# EAGLE design SCANOPCB V2 (EAGLE 7.7.0)
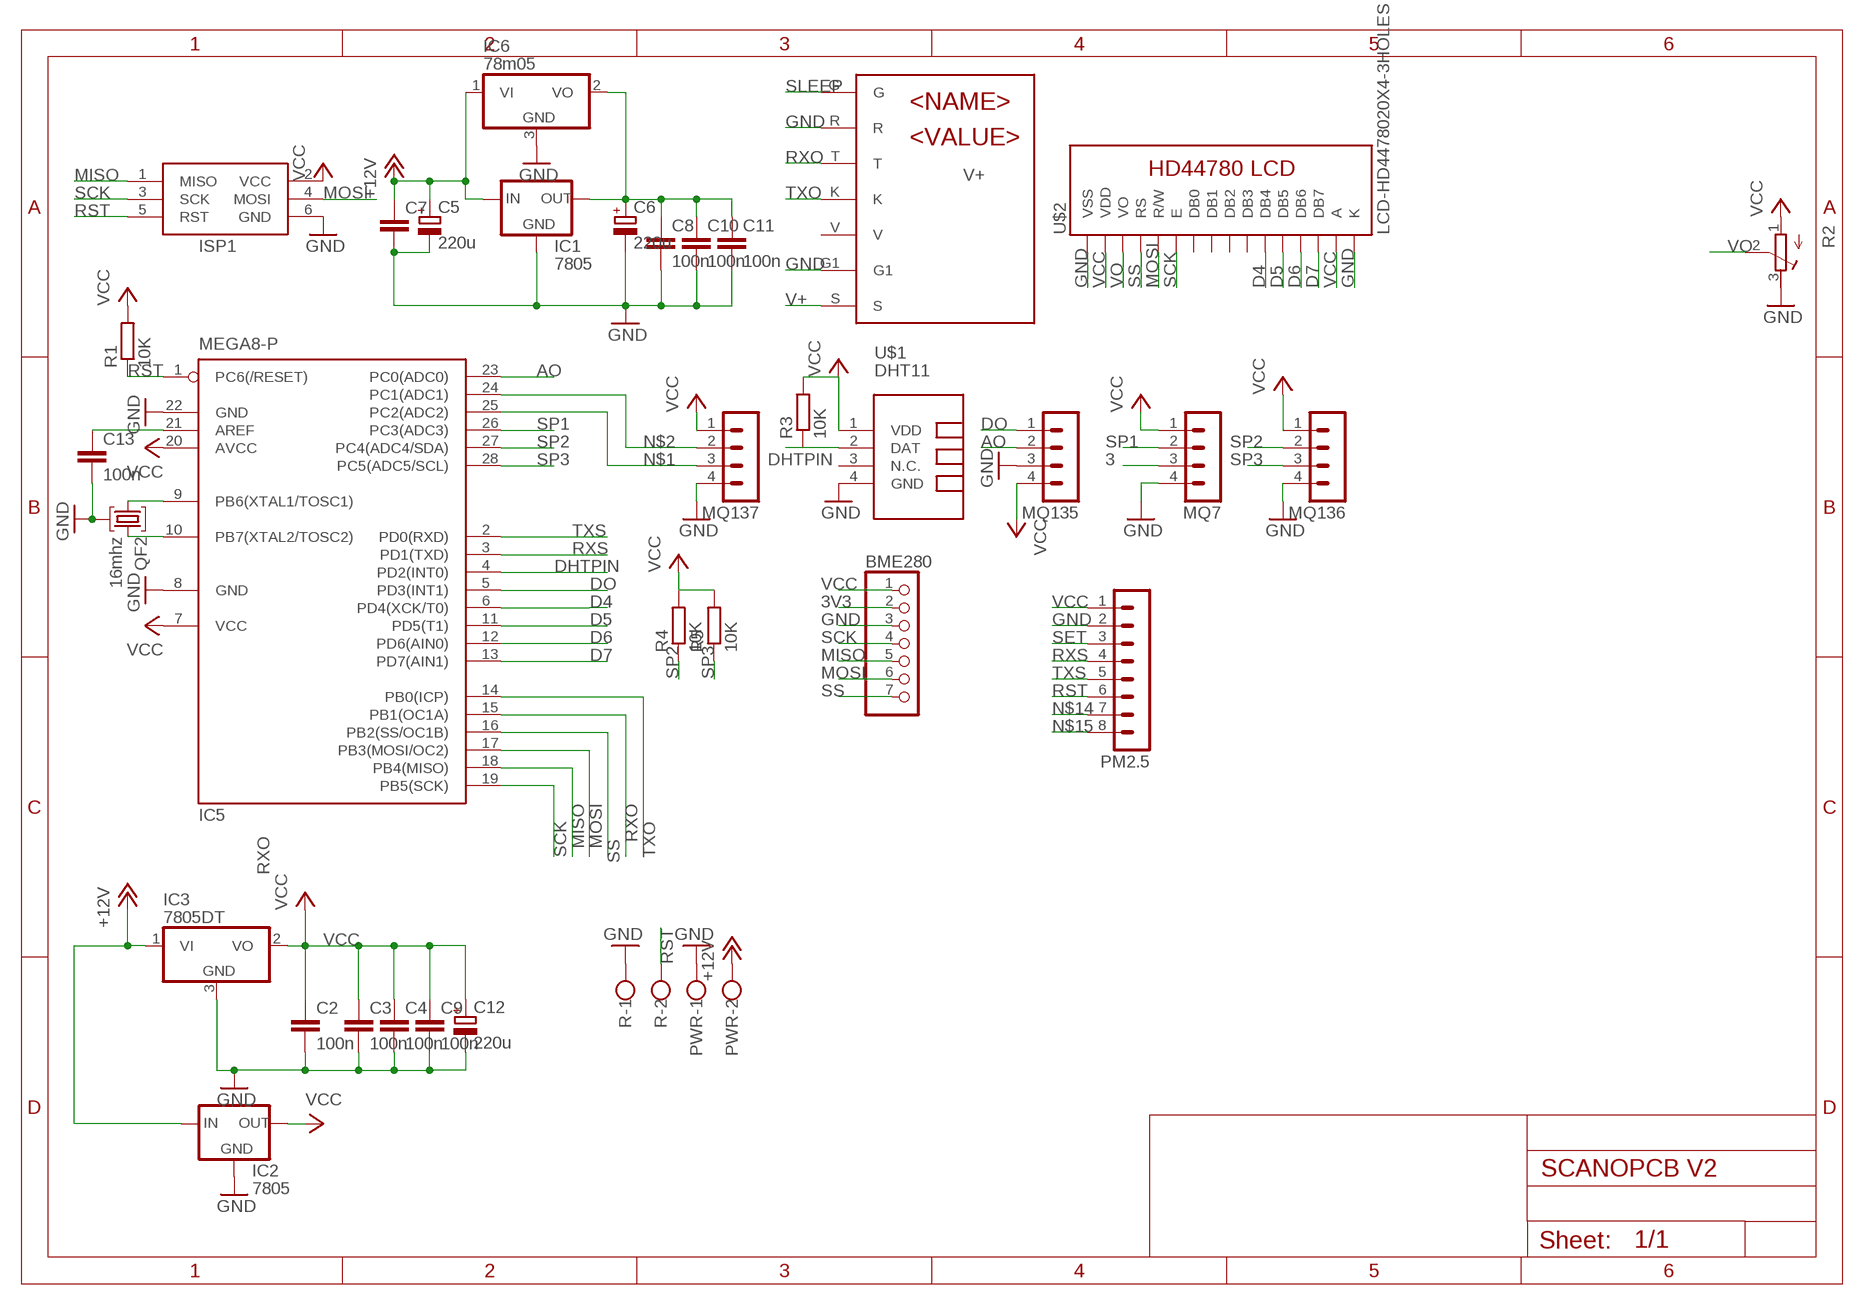
[diagram p0: schematic, sheet 1]

## Parts
BME280  PINHD-1X7  [1X07]
C2  100n  C-EUC1206  [C1206]
C3  100n  C-EUC1206  [C1206]
C4  100n  C-EUC1206  [C1206]
C5  220u  CPOL-EUE5-8.5  [E5-8,5]
C6  220u  CPOL-EUE5-8.5  [E5-8,5]
C7  C-EUC1206  [C1206]
C8  100n  C-EUC1206  [C1206]
C9  100n  C-EUC1206  [C1206]
C10  100n  C-EUC1206  [C1206]
C11  100n  C-EUC1206  [C1206]
C12  220u  CPOL-EUE5-8.5  [E5-8,5]
C13  100n  C-EUC1206  [C1206]
IC1  7805  78XXL  [78XXL]
IC2  7805  78XXL  [78XXL]
IC3  7805DT  [TO252]
IC5  MEGA8-P  [DIL28-3]
IC6  78m05  7812DT  [TO252]
ISP1  AVRISP-6  [AVRISP]
MQ7  MA04-1  [MA04-1]
MQ135  MA04-1  [MA04-1]
MQ136  MA04-1  [MA04-1]
MQ137  MA04-1  [MA04-1]
PM2.5  MA08-1  [MA08-1]
PWR  W237-102  [W237-102]
QF2  16mhz  49M8AHC49T  [HC49U]
R  W237-102  [W237-102]
R1  10K  R-EU_R1206  [R1206]
R2  R-TRIMM64P  [RTRIM64P]
R3  10K  R-EU_R1206  [R1206]
R4  10K  R-EU_R1206  [R1206]
R5  10K  R-EU_R1206  [R1206]
SIM7000  SIM7000  [SIM7000]
U$1  DHT11  TEMP-HUM-SENSOR-DHT11  [TEMP-HUM-SENSOR-DHT11]
U$2  LCD-HD4478020X4-3HOLES  [LCD-20X4-3HOLES]

## Nets
3: MQ7.3
3V3: BME280.2
+12V: C5.+ C7.1 IC1.IN IC2.IN IC3.1(VI) IC6.1(VI) PWR.2
AO: IC5.23(PC0(ADC0)) MQ135.2
D4: IC5.6(PD4(XCK/T0)) U$2.P$11(DB4)
D5: IC5.11(PD5(T1)) U$2.P$12(DB5)
D6: IC5.12(PD6(AIN0)) U$2.P$13(DB6)
D7: IC5.13(PD7(AIN1)) U$2.P$14(DB7)
DHTPIN: IC5.4(PD2(INT0)) R3.1 U$1.2(DAT)
DO: IC5.5(PD3(INT1)) MQ135.1
GND: BME280.3 C2.2 C3.2 C4.2 C5.- C6.- C7.2 C8.2 C9.2 C10.2 C11.2 C12.- C13.2 IC1.GND IC2.GND IC3.3(GND) IC5.8(GND) IC5.22(GND) IC6.3(GND) ISP1.6(GND) MQ7.4 MQ135.3 MQ136.4 MQ137.4 PM2.5.2 PWR.1 QF2.2 R2.3(E) R.1 SIM7000.G1 SIM7000.R U$1.4(GND) U$2.P$1(VSS) U$2.P$16(K)
MISO: BME280.5 IC5.18(PB4(MISO)) ISP1.1(MISO)
MOSI: BME280.6 IC5.17(PB3(MOSI/OC2)) ISP1.4(MOSI) U$2.P$5(R/W)
N$1: IC5.25(PC2(ADC2)) MQ137.3
N$2: IC5.24(PC1(ADC1)) MQ137.2
N$3: C13.1 IC5.21(AREF)
N$8: IC5.9(PB6(XTAL1/TOSC1)) QF2.1
N$9: IC5.10(PB7(XTAL2/TOSC2)) QF2.3
N$14: PM2.5.7
N$15: PM2.5.8
RST: IC5.1(PC6(/RESET)) ISP1.5(RST) PM2.5.6 R1.1 R.2
RXO: IC5.15(PB1(OC1A)) SIM7000.T
RXS: IC5.3(PD1(TXD)) PM2.5.4
SCK: BME280.4 IC5.19(PB5(SCK)) ISP1.3(SCK) U$2.P$6(E)
SET: PM2.5.3
SLEEP: SIM7000.G
SP1: IC5.26(PC3(ADC3)) MQ7.2
SP2: IC5.27(PC4(ADC4/SDA)) MQ136.2 R4.1
SP3: IC5.28(PC5(ADC5/SCL)) MQ136.3 R5.1
SS: BME280.7 IC5.16(PB2(SS/OC1B)) U$2.P$4(RS)
TXO: IC5.14(PB0(ICP)) SIM7000.K
TXS: IC5.2(PD0(RXD)) PM2.5.5
V+: C6.+ C8.1 C10.1 C11.1 IC1.OUT IC6.2(VO) SIM7000.S
VCC: BME280.1 C2.1 C3.1 C4.1 C9.1 C12.+ IC2.OUT IC3.2(VO) IC5.7(VCC) IC5.20(AVCC) ISP1.2(VCC) MQ7.1 MQ135.4 MQ136.1 MQ137.1 PM2.5.1 R1.2 R2.1(A) R3.2 R4.2 R5.2 U$1.1(VDD) U$2.P$2(VDD) U$2.P$15(A)
VO: R2.2(S) U$2.P$3(VO)
Unconnected: SIM7000.V U$1.3(N.C.) U$2.P$7(DB0) U$2.P$8(DB1) U$2.P$9(DB2) U$2.P$10(DB3)

## Library data of the parts
BME280 = pinhead:PINHD-1X7: PIN HEADER
C2-C4 C7-C11 C13 = resistor:C-EU: CAPACITOR, European symbol
C5 C6 C12 = resistor:CPOL-EU: POLARIZED CAPACITOR, European symbol
IC1 IC2 = v-reg:78XXL: VOLTAGE REGULATOR
IC3 = linear:78*: Positive VOLTAGE REGULATOR Source: http://cache.national.com/ds/LM/LM78L05.pdf http://www.fairchildsemi.com/ds/LM/LM7805.pdf
IC5 = atmel:MEGA8-P: MICROCONTROLLER 8 Kbytes FLASH, 1 kbytes SRAM, 512 bytes EEPROM, USART, 4-channel 10 bit ADC, 2-channel 8 bit ADC Pin compatible with Atmega48, ATMega88, ATMega168 Source: avr.lbr; OC_FARNELL: unknown; OC_NEWARK: unknown
IC6 = adafruit:78*: Positive VOLTAGE REGULATOR Added bigger pads to the TO-92 package
ISP1 = adafruit:AVRISP: AVR ISP HEADER Standard 6 pin header for AVR programming
MQ7 MQ135-MQ137 = con-lstb:MA04-1: PIN HEADER; OC_FARNELL: unknown; OC_NEWARK: unknown
PM2.5 = con-lstb:MA08-1: PIN HEADER; OC_FARNELL: unknown; OC_NEWARK: unknown
PWR R = con-wago-500:W237-102: WAGO SCREW CLAMP; MPN: 237-102; OC_FARNELL: unknown; OC_NEWARK: 70K9898
QF2 = crystal:49M8AHC49T: Monolithic Crystal Filters Source: www.vanlong.com; OC_FARNELL: unknown; OC_NEWARK: unknown
R1 R3-R5 = resistor:R-EU_: RESISTOR, European symbol
R2 = resistor:R-TRIMM: Trimm resistor
SIM7000 = sim7000:SIM7000
U$1 = diy-modules:TEMP-HUM-SENSOR-DHT11: DHT11 - digital humidity & temperature sensor DHT11 datasheet available here: https://akizukidenshi.com/download/ds/aosong/DHT11.pdf Click here to find device on ebay.com <http://www.ebay.com/sch/dht11+digital+sensor>
U$2 = HD44780LCD:LCD-HD44780

## Board
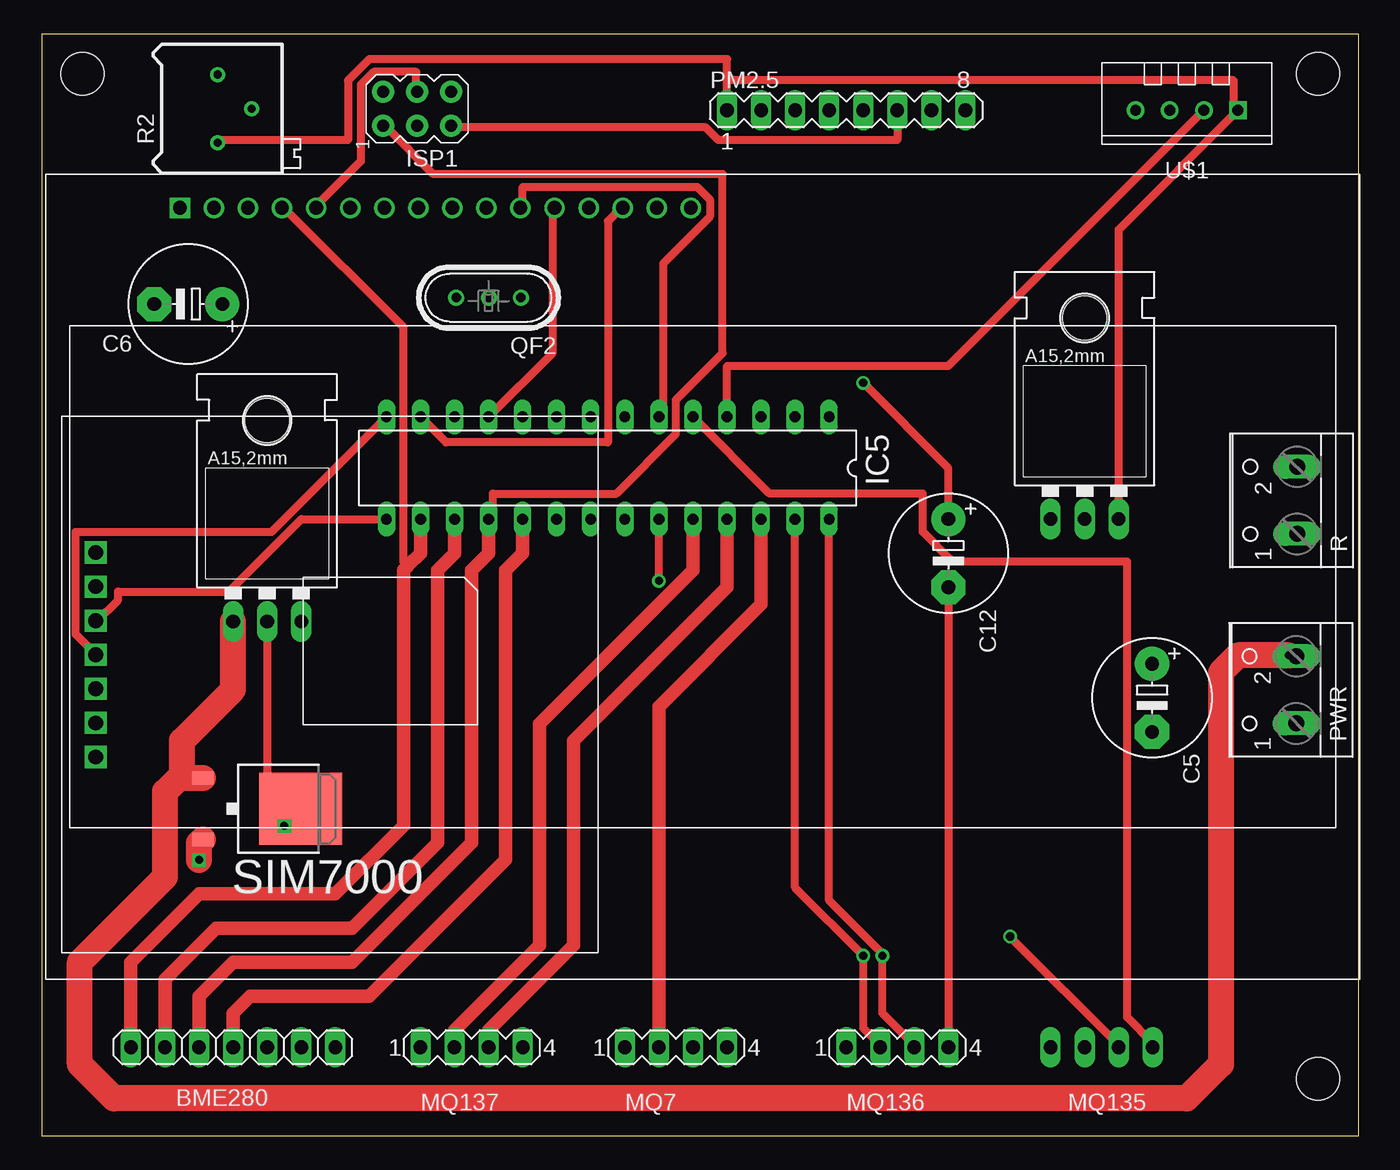
[diagram p1: board, top side]
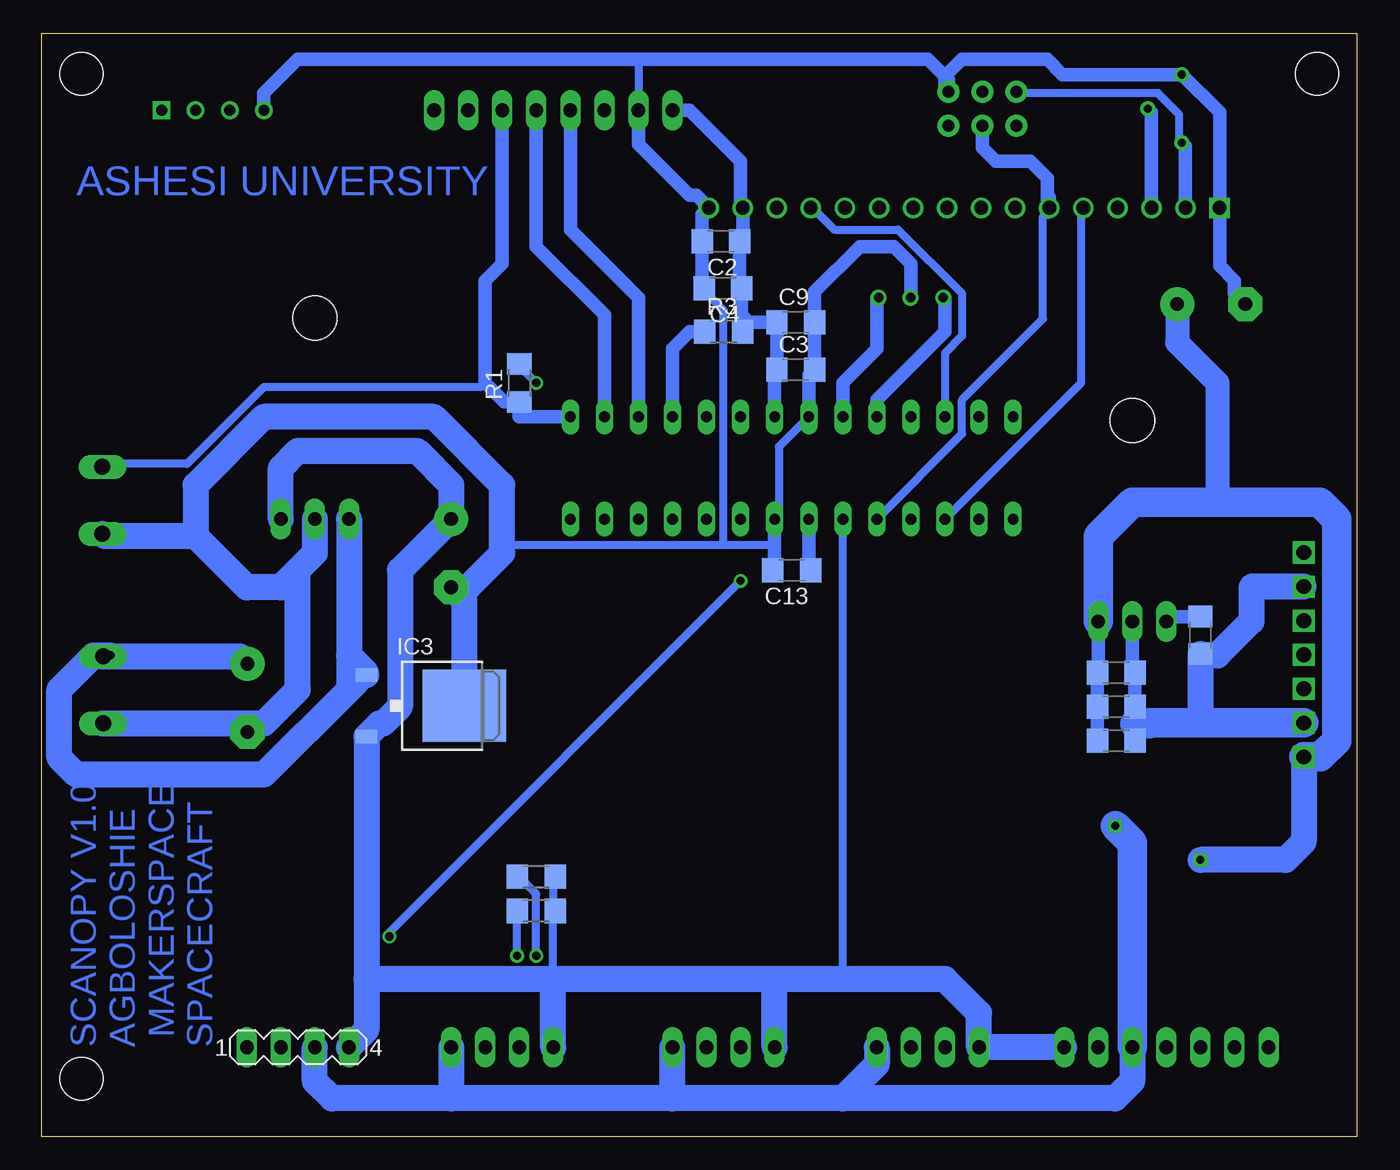
[diagram p2: board, bottom side, seen from below]

Size 98.14 x 82.19 mm. Coordinates in mm from the lower left corner, seen from the top.
Outline: 0,0 0,82.19 98.14,82.19 98.14,0 0,0
Copper layers (1*16): Top 0.035mm / dielectric 1.5mm / Bottom 0.035mm
Design rules "default *": minimum track width 24mil, minimum drill 24mil, track to track 10mil, track to pad 10mil, pad to pad 8mil, via to via 8mil, smd to smd 8mil, copper to edge 0mil, drill to drill 8mil, minimum pad ring 10mil, minimum via ring 8mil, stop-mask expansion 4mil, vias tented up to drill 0mil, thermal gap 10mil
Holes 3.2 mm at 95.14,79.19 95.14,4.27 3,79.19

### Footprints (pad centres in the part's own frame; a part is rotated, then mirrored left to right if it is on the bottom)
1X07 = drill 1.016 long: 1 -7.62,0; 2 -5.08,0; 3 -2.54,0; 4 0,0; 5 2.54,0; 6 5.08,0; 7 7.62,0
C1206 = smd 1.6 x 1.8: 1 -1.4,0; 2 1.4,0
E5-8,5 = drill 1.016 pad 2.54: + -2.54,0 | drill 1.016 pad 2.54 octagon: - 2.54,0
78XXL = drill 1.016 long: GND 0,-3.81; IN -2.54,-3.81; OUT 2.54,-3.81 | hole 3.302: 0,11.176
TO252 = smd 1 x 1.6: 1 -2.28,-4.8; 2 2.28,-4.8 | smd 5.4 x 6.2: 3 0,2.5
DIL28-3 = drill 0.813 long: 1 -16.51,-3.81; 2 -13.97,-3.81; 3 -11.43,-3.81; 4 -8.89,-3.81; 5 -6.35,-3.81; 6 -3.81,-3.81; 7 -1.27,-3.81; 8 1.27,-3.81; 9 3.81,-3.81; 10 6.35,-3.81; 11 8.89,-3.81; 12 11.43,-3.81; 13 13.97,-3.81; 14 16.51,-3.81; 15 16.51,3.81; 16 13.97,3.81; 17 11.43,3.81; 18 8.89,3.81; 19 6.35,3.81; 20 3.81,3.81; 21 1.27,3.81; 22 -1.27,3.81; 23 -3.81,3.81; 24 -6.35,3.81; 25 -8.89,3.81; 26 -11.43,3.81; 27 -13.97,3.81; 28 -16.51,3.81
AVRISP = drill 0.9 pad 1.626: 1 -1.27,2.54; 2 1.27,2.54; 3 -1.27,0; 4 1.27,0; 5 -1.27,-2.54; 6 1.27,-2.54
MA04-1 = drill 1.016 long: 1 -3.81,0; 2 -1.27,0; 3 1.27,0; 4 3.81,0
MA08-1 = drill 1.016 long: 1 -8.89,0; 2 -6.35,0; 3 -3.81,0; 4 -1.27,0; 5 1.27,0; 6 3.81,0; 7 6.35,0; 8 8.89,0
W237-102 = drill 1.194 long: 1 -2.5,-1.27; 2 2.5,-1.27
HC49U = drill 0.7 pad 1.2: 1 -2.413,0; 2 -0.027,0; 3 2.413,0
R1206 = smd 1.6 x 1.803: 1 -1.422,0; 2 1.422,0
RTRIM64P = drill 0.61: 1 0,-2.54; 2 2.54,0; 3 0,2.54
SIM7000 = drill 1.1 square: G 2.54,-10.16; G1 2.54,-22.86; K 2.54,-17.78; R 2.54,-12.7; S 2.54,-25.4; T 2.54,-15.24; V 2.54,-20.32
TEMP-HUM-SENSOR-DHT11 = drill 0.8 square: 1 -3.81,0 | drill 0.8: 2 -1.27,0; 3 1.27,0; 4 3.81,0
LCD-20X4-3HOLES = drill 1.016 square: P$1 10,57.5 | drill 1.016: P$2 12.54,57.5; P$3 15.08,57.5; P$4 17.62,57.5; P$5 20.16,57.5; P$6 22.7,57.5; P$7 25.24,57.5; P$8 27.78,57.5; P$9 30.32,57.5; P$10 32.86,57.5; P$11 35.4,57.5; P$12 37.94,57.5; P$13 40.48,57.5; P$14 43.02,57.5; P$15 45.56,57.5; P$16 48.1,57.5

### Placement (x,y rotation side)
BME280  14.24,6.62 180 top
C2  47.46,66.7 180 bottom
C3  41.88,57.13 0 bottom
C4  47.31,63.2 180 bottom
C5  82.77,32.67 270 top
C6  10.89,62.02 180 top
C7  11.7,37.32 270 bottom
C8  17.98,32.01 0 bottom
C9  41.88,60.67 0 bottom
C10  17.98,34.55 0 bottom
C11  17.98,29.47 0 bottom
C12  67.58,43.45 270 top
C13  42.18,42.18 180 bottom
IC1  16.78,42.18 0 top
IC2  77.74,49.8 0 top
IC3  69.09,32.08 270 bottom
IC5  42.18,49.8 180 top
IC6  16.78,24.4 270 top
ISP1  27.96,76.59 90 top
MQ7  47.26,6.62 0 top
MQ135  79.01,6.62 0 bottom
MQ136  63.77,6.62 0 top
MQ137  32.02,6.62 0 top
PM2.5  59.96,76.47 0 top
PWR  92.26,33.26 90 top
QF2  33.29,62.5 180 top
R  92.31,47.39 90 top
R1  62.5,56.15 90 bottom
R2  13.08,76.59 0 top
R3  47.26,59.96 0 bottom
R4  61.23,19.32 0 bottom
R5  61.23,16.78 0 bottom
SIM7000  1.46,53.66 0 top
U$1  85.36,76.47 180 top
U$2  0.27,11.7 0 top

### Tracks (layer width: path | path; a pad name or v marks a point on that pad's centre or on a via)
+12V  (via drill 0.6)
  Top 1.93: v92.98,35.83 89.17,35.83 87.9,34.56 87.9,5.35 85.36,2.81 5.35,2.81 2.81,5.35 2.81,12.97 9.16,19.32 9.16,25.67 10.43,26.94 | 10.43,26.94 10.43,29.48 14.24,33.29 IC1.IN | IC6.1 10.69,26.68 10.43,26.94
  Bottom 0.61: 73.93,34.56 IC3.1
  Bottom 1.016: C7.1 13.89,38.72 IC1.IN
  Bottom 1.93: C5.+ 83.32,35.76 PWR.2 93.6,35.83 | IC2.IN 75.2,35.83 | 75.2,35.83 73.93,34.56 | 75.2,35.83 75.2,33.29 | 75.2,33.29 81.55,26.94 95.52,26.94 96.79,28.21 96.79,33.29 94.25,35.83 93.6,35.83 | IC3.1 74.13,34.36 75.2,33.29 | 93.6,35.83 v92.98,35.83
AO  (via drill 0.61)
  Top 0.61: v45.99,41.39 IC5.23 | v72.18,14.88 80.28,6.78 MQ135.2
  Bottom 0.61: v45.99,41.39 72.18,15.19 v72.18,14.88
D4
  Top 0.61: IC5.6 46.31,53.93 46.31,65.04 49.8,68.53 49.8,69.8 48.85,70.75 35.83,70.75 35.83,69.48 U$2.P$11
D5
  Top 0.61: IC5.11 38.05,58.37 38.05,69.17 U$2.P$12
D6
  Bottom 0.61: IC5.12 30.75,58.37 29.48,59.64 29.48,62.82 34.24,67.58 39,67.58 40.59,69.17 U$2.P$13
D7
  Top 0.61: IC5.13 30.11,51.7 42.18,51.7 42.18,68.22 43.13,69.17 U$2.P$14
DHTPIN
  Top 0.61: U$1.2 67.58,57.42 51.07,57.42 IC5.4
  Bottom 1.016: IC5.4 51.07,58.69 49.8,59.96 R3.1
DO
  Top 0.61: IC5.5 54.24,47.89 65.67,47.89 65.67,45.04 67.9,42.81 80.91,42.81 80.91,8.84 82.82,6.94 MQ135.1
GND  (via drill 0.6)
  Top 0.61: IC1.GND 16.78,26.62 19,24.4 IC6.3 | C12.- MQ136.4
  Top 2.184: v18.05,23.13 18.05,23.17 IC6.3
  Bottom 0.61: 53.61,80.28 PM2.5.2 | IC5.8 43.13,51.39 43.13,46.31 IC5.22 | 63.77,44.09 47.26,44.09 | 47.26,44.09 43.45,44.09 | 47.26,44.09 47.26,61.55 48.53,62.82 C4.2
  Bottom 1.016: IC1.GND 16.78,34.75 C10.2 C8.2 16.58,30.75 C11.2 | IC5.8 40.91,56.7 C3.2 C9.2 40.48,62.93 37.1,66.31 34.56,66.31 33.29,65.04 33.29,62.53 QF2.2 | C4.2 48.86,63.35 C2.2 48.86,68.71 U$2.P$16 | U$2.P$16 48.37,69.01 48.53,68.85 | PM2.5.2 53.61,73.93 49.8,70.12 49.29,70.12 U$2.P$16 | U$1.4 81.55,77.74 79.01,80.28 53.61,80.28 32.02,80.28 30.5,78.76 ISP1.6 30.75,78.11 30.75,79.01 29.48,80.28 23.13,80.28 21.98,79.13 R2.3 10.27,76.32 U$2.P$1 10.27,64.88 9.16,63.77 9.16,62.83 C6.- | IC5.22 43.45,44.09 43.45,42.31 C13.2
  Bottom 1.93: PWR.1 83.4,30.76 | 83.4,30.76 C5.- | IC2.GND 77.74,43.45 79.01,42.18 | 79.01,42.18 80.28,40.91 82.82,40.91 86.63,44.72 | 86.63,44.72 93.41,44.72 R.1 | 83.4,30.76 81.54,30.76 79.01,33.29 79.01,42.18 | IC3.3 66.59,39.92 C12.- 66.31,40.91 63.77,43.45 63.77,44.09 63.77,48.53 68.85,53.61 81.55,53.61 86.63,48.53 86.63,44.72 | MQ137.4 35.83,5.35 38.37,2.81 | 51.07,2.81 67.58,2.81 | 67.58,2.81 76.47,2.81 77.74,4.08 MQ135.3 | MQ136.4 67.58,2.81 | 38.37,2.81 51.07,2.81 | 51.07,2.81 MQ7.4 | BME280.3 16.78,4.08 18.05,2.81 38.37,2.81 | 11.7,30.8 C7.2 11.61,35.83 10.43,35.83 7.89,38.37 7.89,40.91 7.84,40.96 SIM7000.R
  Bottom 2.184: SIM7000.G1 11.7,30.8 15.46,30.8 15.51,30.75 16.58,30.75 | BME280.3 16.78,21.86 v18.05,23.13
MISO
  Top 0.61: ISP1.1 25.67,75.2 29.16,71.71 50.75,71.71 50.75,58.37 47.26,54.88 47.26,52.34 42.81,47.89 33.61,47.89 33.61,46.31 IC5.18
  Top 1.016: IC5.18 33.29,43.45 32.02,42.18 32.02,21.86 23.13,12.97 14.24,12.97 11.7,10.43 BME280.5
MOSI
  Top 0.61: U$2.P$5 20.59,69.48 23.76,72.66 23.76,78.38 24.72,79.33 27.89,79.33 27.89,78.06 ISP1.4
  Top 1.016: BME280.6 9.16,11.7 12.97,15.51 23.13,15.51 29.48,21.86 29.48,42.18 30.75,43.45 IC5.17
  Bottom 0.61: IC5.17 20.59,56.15 20.59,69.17 U$2.P$5
N$1
  Top 1.016: MQ137.3 33.29,7.89 39.64,14.24 39.64,29.48 51.07,40.91 IC5.25
N$2
  Top 1.016: IC5.24 48.53,42.18 37.1,30.75 37.1,14.24 30.75,7.89 MQ137.2
N$3
  Bottom 1.016: IC5.21 40.91,42.18 C13.1
N$8
  Bottom 1.016: IC5.9 38.37,56.15 35.83,58.69 35.83,62.37 QF2.1
N$9
  Bottom 1.016: IC5.10 35.83,54.88 30.75,59.96 30.75,62.37 QF2.3
RST
  Top 0.61: PM2.5.6 63.77,74.25 50.44,74.25 49.48,75.2 30.75,75.2 ISP1.5
  Bottom 0.61: R.2 93.3,50.12 87.26,50.12 81.55,55.83 65.36,55.83 65.04,56.15
  Bottom 1.016: IC5.1 62.5,53.61 R1.1 63.62,54.73 65.04,56.15 65.04,63.77 63.77,65.04 PM2.5.6
RXO
  Top 0.61: IC5.15 19.32,45.99 13.92,40.59 5.67,40.59 5.67,39.96 4.08,38.37 SIM7000.T
RXS
  Bottom 1.016: IC5.3 53.61,62.5 58.69,67.58 PM2.5.4
SCK
  Top 1.016: BME280.4 14.24,9.16 15.51,10.43 24.4,10.43 34.56,20.59 34.56,42.18 35.83,43.45 IC5.19
  Bottom 0.61: IC5.19 29.48,52.34 29.48,54.88 23.45,60.91 23.45,68.53 23.13,68.85
  Bottom 1.016: ISP1.3 27.96,73.68 26.94,72.66 24.4,72.66 23.13,71.39 23.13,70.12 | 23.13,70.12 23.13,69.36 | 23.13,69.36 U$2.P$6 22.97,69.96 23.13,70.12 | 23.13,69.36 23.13,68.85
SP1
  Top 1.016: MQ7.2 45.99,32.02 53.61,39.64 IC5.26
SP2  (via drill 0.61)
  Top 0.61: MQ136.2 62.5,6.78 61.23,8.05 v61.23,13.45 56.15,18.53 IC5.27
  Bottom 0.61: v61.23,13.45 61.23,18.05 62.5,19.32 R4.1
SP3  (via drill 0.61)
  Top 0.61: MQ136.3 65.04,6.78 62.66,9.16 v62.66,13.45 62.66,13.61 58.69,17.57 IC5.28
  Bottom 0.61: v62.66,13.45 R5.1
SS
  Top 0.61: U$2.P$4 18.05,69.17 26.94,60.28 26.94,42.81 27.26,42.5
  Top 1.016: IC5.16 28.21,43.45 27.26,42.5 26.94,42.18 26.94,23.13 21.86,18.05 11.7,18.05 6.62,12.97 BME280.7
TXO
  Top 0.61: IC5.14 17.1,45.04 2.49,45.04 2.49,37.42 3.76,36.15 SIM7000.K
TXS
  Bottom 1.016: PM2.5.5 61.23,66.31 56.15,61.23 IC5.2
V+  (via drill 0.6)
  Top 1.93: v11.7,20.59 11.7,21.84 IC6.2
  Bottom 1.016: IC1.OUT 19.32,34.61 C10.1 C8.1 C11.1
  Bottom 1.778: C6.+ 13.43,59.15 10.43,56.15 10.43,47.26
  Bottom 1.93: SIM7000.S 4,21.94 5.35,20.59 v11.7,20.59
  Bottom 2.184: SIM7000.S 2.76,28.26 1.54,29.48 1.54,45.99 2.81,47.26 10.43,47.26 16.78,47.26 19.32,44.72 IC1.OUT
VCC  (via drill 0.61)
  Top 0.61: PM2.5.1 51.07,78.69 | 51.07,78.69 51.07,80.28 24.4,80.28 22.81,78.69 22.81,74.25 13.29,74.25 R2.1 | v61.23,56.15 67.58,49.8 C12.+ | IC2.OUT 80.28,67.58 U$1.1 88.85,76.47 88.85,78.69 51.07,78.69
  Bottom 0.61: ISP1.2 25.35,77.74 14.88,77.74 13.29,76.15 13.29,74.25 R2.1 | v61.23,56.15 62.5,57.42 R1.2 | 38.37,11.7 IC5.20 | R4.2 59.96,19.32 59.96,16.78 R5.2 59.96,16.62 59.96,11.7
  Bottom 1.016: U$2.P$2 12.81,73.78 R2.1 | 45.91,61.23 C4.1 46.06,63.35 C2.1 45.83,66.93 U$2.P$15 45.99,69.36 45.99,72.66 49.8,76.47 PM2.5.1 | 45.91,61.23 45.91,60.03 R3.2 | 45.91,61.23 45.35,60.67 C9.1 C3.1 43.45,56.96 IC5.7
  Bottom 1.93: IC2.OUT 80.28,49.8 79.01,51.07 70.12,51.07 67.58,48.53 C12.+ 71.39,42.18 71.39,32.02 72.66,30.75 72.94,30.75 IC3.2 73.89,11.7 | 73.89,11.7 73.89,7.93 MQ135.4 | BME280.1 MQ137.1 28.21,9.16 30.75,11.7 38.37,11.7 43.45,11.7 | 43.45,11.7 59.96,11.7 | 59.96,11.7 73.89,11.7 | MQ7.1 43.45,11.7 | MQ136.1 59.96,11.7
VO
  Bottom 1.016: U$2.P$3 15.35,76.32 R2.2

### Text on the board
Bottom: ASHESI UNIVERSITY | SCANOPY V1.00 / AGBOLOSHIE / MAKERSPACE / SPACECRAFT